# EasyEDA Pro project ProPrj_STM32音响_2025-06-08.epro, schematic Power_Lite
Board Name: Power_Lite; Create Date: 2025-05-30; Page Name: P1; Project Name: Project_NEO; Schematic Name: Power_Lite; Update Date: 2025-06-01; Company: 嘉立创EDA; Page Size: A4; Version: V1.0
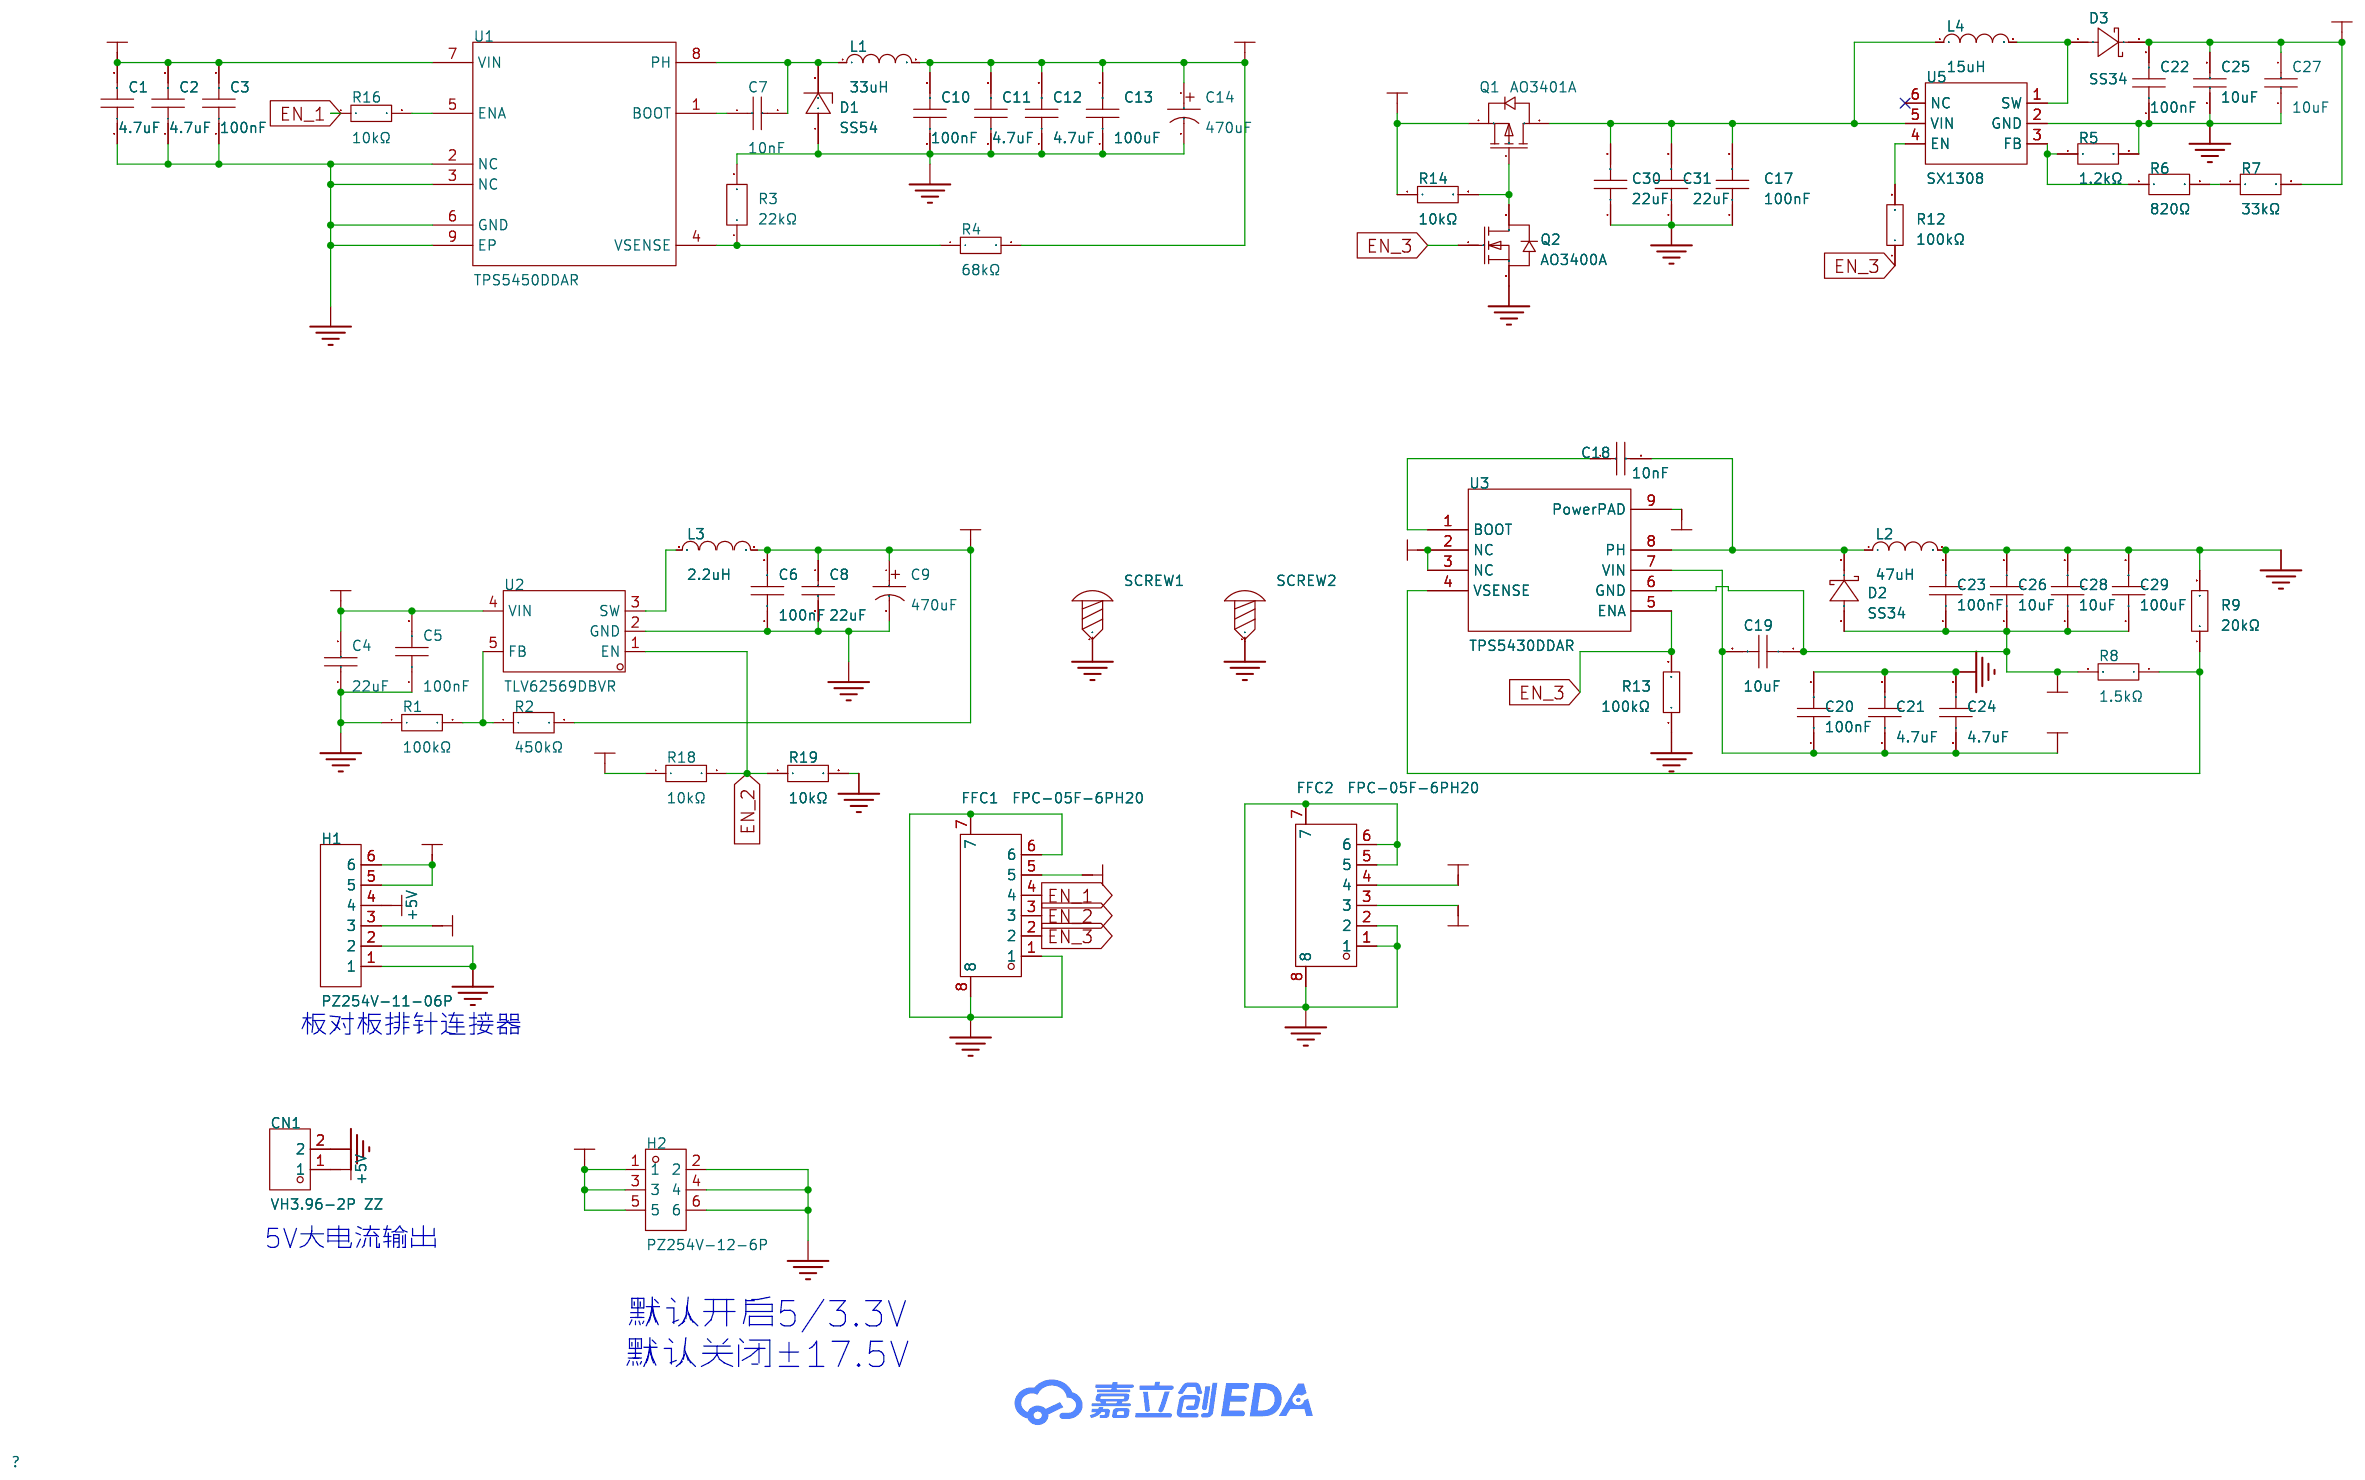
[diagram p4: schematic sheet]

## Parts
C1  4.7uF  [C0805]
C2  4.7uF  [C0805]
C3  100nF  [C0603]
C4  22uF  [C1206]
C5  100nF  [C0603]
C6  100nF  [C0603]
C7  10nF  [C0603]
C8  22uF  [C1206]
C9  470uF  [CAP-TH_BD6.3-P2.50-D1.0-FD]
C10  100nF  [C0603]
C11  4.7uF  [C0805]
C12  4.7uF  [C0805]
C13  100uF  [C1210]
C14  470uF  [CAP-TH_BD6.3-P2.50-D1.0-FD]
C17  100nF  [C0603]
C18  10nF  [C0603]
C19  10uF  [C1206]
C20  100nF  [C0603]
C21  4.7uF  [C0805]
C22  100nF  [C0603]
C23  100nF  [C0603]
C24  4.7uF  [C0805]
C25  10uF  [C1206]
C26  10uF  [C0805]
C27  10uF  [C1206]
C28  10uF  [C0805]
C29  100uF  [C1210]
C30  22uF  [C1206]
C31  22uF  [C1206]
CN1  VH3.96-2P ZZ  [CONN-TH_2P-P3.96_C9900035759]
D1  SS54  [SMA_L4.3-W2.6-LS5.0-FD]
D2  SS34  [SMA_L4.3-W2.6-LS5.0-FD]
D3  SS34  [SMA_L4.3-W2.6-LS5.0-FD]
FFC1  FPC-05F-6PH20  [FPC-SMD_6P-P0.50_XUNPU_FPC-05F-6PH20]
FFC2  FPC-05F-6PH20  [FPC-SMD_6P-P0.50_XUNPU_FPC-05F-6PH20]
H1  PZ254V-11-06P  [HDR-TH_6P-P2.54-V-M]
H2  PZ254V-12-6P  [HDR-TH_6P-P2.54-V-M-R2-C3-S2.54]
L1  33uH  [IND-SMD_L11.5-W10.0_FXL1040]
L2  47uH  [IND-SMD_L7.0-W6.6_FXL0630]
L3  2.2uH  [IND-SMD_L4.4-W4.2]
L4  15uH  [IND-SMD_L5.4-W5.2]
Q1  AO3401A  [SOT-23_L2.9-W1.3-P1.90-LS2.4-BR]
Q2  AO3400A  [SOT-23-3_L2.9-W1.3-P1.90-LS2.4-BR]
R1  100kΩ  [R0603]
R2  450kΩ  [R0402]
R3  22kΩ  [R0603]
R4  68kΩ  [R0603]
R5  1.2kΩ  [R0603]
R6  820Ω  [R0603]
R7  33kΩ  [R0603]
R8  1.5kΩ  [R0603]
R9  20kΩ  [R0603]
R12  100kΩ  [R0603]
R13  100kΩ  [R0603]
R14  10kΩ  [R0603]
R16  10kΩ  [R0603]
R18  10kΩ  [R0402]
R19  10kΩ  [R0402]
SCREW1  -  [M2螺丝]
SCREW2  -  [M2螺丝]
U1  TPS5450DDAR  [SOP-8_L4.9-W3.9-P1.27-LS6.0-BL-EP]
U2  TLV62569DBVR  [SOT-23-5_L3.0-W1.7-P0.95-LS2.8-BR]
U3  TPS5430DDAR  [ESOP-8_L4.9-W3.9-P1.27-LS6.0-TL-EP]
U5  SX1308  [SOT-23-6_L2.9-W1.6-P0.95-LS2.8-BL]

## Library data of the parts
C1 C2 C11 C12 C21 C24 = CGA0805X7R475K350MT: 容值:4.7uF;精度:±10%;额定电压:35V;材质(温度系数):X7R;; LCSC Part Name: 4.7uF ±10% 35V; Supplier Part: C6119943; Manufacturer: HRE(芯声); Supplier Footprint: 0805; JLCPCB Part Class: 扩展库; Supplier: LCSC; Tolerance: ±10%; Voltage Rated: 35V; Temperature Coefficient: X7R
C3 C5 C6 C10 C17 C20 C22 C23 = CGA0603X7R104K500JT: 容值:100nF;精度:±10%;额定电压:50V;材质(温度系数):X7R;; LCSC Part Name: 100nF ±10% 50V; Supplier Part: C6119867; Manufacturer: HRE(芯声); Supplier Footprint: 0603; JLCPCB Part Class: Extended Part; Supplier: LCSC; Tolerance: ±10%; Voltage Rated: 50V; Temperature Coefficient: X7R
C4 C8 = CL31A226KPHNNNE: 容值:22uF;精度:±10%;额定电压:10V;材质(温度系数):X5R;; LCSC Part Name: 22uF ±10% 10V; Supplier Part: C5672; Manufacturer: SAMSUNG(三星); Supplier Footprint: 1206; JLCPCB Part Class: 扩展库; Datasheet: https://atta.szlcsc.com/upload/public/pdf/source/20171115/C5672_15107278524311120028.pdf; Supplier: LCSC; Tolerance: ±10%; Voltage Rated: 10V; Temperature Coefficient: X5R
C7 C18 = CC0603KRX7R9BB103: 容值:10nF;精度:±10%;额定电压:50V;材质(温度系数):X7R;; LCSC Part Name: 10nF ±10% 50V; Supplier Part: C100042; Manufacturer: YAGEO(国巨); Supplier Footprint: 0603; JLCPCB Part Class: 扩展库; Datasheet: https://atta.szlcsc.com/upload/public/pdf/source/20181008/C309510_22F155564471FAF6A489F7D68F34234E.pdf; Supplier: LCSC; Tolerance: ±10%; Voltage Rated: 50V; Temperature Coefficient: X7R
C9 C14 = ERR1AM471E11OT: 容值:470uF;精度:±20%;额定电压:10V;纹波电流:-;等效串联电阻:-;; LCSC Part Name: 470uF ±20% 10V; Supplier Part: C112505; Manufacturer: AISHI(艾华集团); Supplier Footprint: 插件,D6.3xL11mm; JLCPCB Part Class: 扩展库; Datasheet: https://atta.szlcsc.com/upload/public/pdf/source/20190702/C401591_1676EF45BC9A88BD1D6B22BBAE3913C7.pdf; Supplier: LCSC; Tolerance: ±20%; Rated Voltage: 10V; Lead Spacing: 2.5mm; φD: 6.3mm; L: 11mm; Lifetime @ Temp: 2000hrs@105℃
C13 C29 = HGC1210R5107M160NSVK: 容值:100uF;精度:±20%;额定电压:16V;温度系数:X5R;; LCSC Part Name: 100uF ±20% 16V; Supplier Part: C7432790; Manufacturer: Chinocera(华瓷); Supplier Footprint: 1210; JLCPCB Part Class: 扩展库; Datasheet: https://atta.szlcsc.com/upload/public/pdf/source/20240320/FAC3FEC40A78BC5CCCE96C232A94D860.pdf; Supplier: LCSC; Tolerance: ±20%; Voltage Rating: 16V; Temperature Coefficient: X5R
C19 = HGC1206R5106K500NSPJ: 容值:10uF;精度:±10%;额定电压:50V;材质(温度系数):X5R;; LCSC Part Name: 10uF ±10% 50V; Supplier Part: C7432781; Manufacturer: Chinocera(华瓷); Supplier Footprint: 1206; JLCPCB Part Class: Extended Part; Datasheet: https://atta.szlcsc.com/upload/public/pdf/source/20240320/FAC3FEC40A78BC5CCCE96C232A94D860.pdf; Supplier: LCSC; Tolerance: ±10%; Voltage Rated: 50V; Temperature Coefficient: X5R
C25 C27 = CL31A106KAHNNNE: 容值:10uF;精度:±10%;额定电压:25V;材质(温度系数):X5R;; LCSC Part Name: 10uF ±10% 25V; Supplier Part: C9807; Manufacturer: SAMSUNG(三星); Supplier Footprint: 1206; JLCPCB Part Class: 扩展库; Datasheet: https://atta.szlcsc.com/upload/public/pdf/source/20160218/1457707763339.pdf; Supplier: LCSC; Tolerance: ±10%; Voltage Rated: 25V; Temperature Coefficient: X5R
C26 C28 = CGA0805X5R106K250MT: 容值:10uF;精度:±10%;额定电压:25V;温度系数:X5R;; LCSC Part Name: 10uF ±10% 25V; Supplier Part: C6119887; Manufacturer: HRE(芯声); Supplier Footprint: 0805; JLCPCB Part Class: 扩展库; Supplier: LCSC; Tolerance: ±10%; Voltage Rating: 25V; Temperature Coefficient: X5R
C30 C31 = CGA1206X5R226M350NT: 容值:22uF;精度:±20%;额定电压:35V;温度系数:X5R;; LCSC Part Name: 22uF ±20% 35V; Supplier Part: C6119969; Manufacturer: HRE(芯声); Supplier Footprint: 1206; JLCPCB Part Class: 扩展库; Supplier: LCSC; Tolerance: ±20%; Voltage Rating: 35V; Temperature Coefficient: X5R
CN1 = VH3.96-2P ZZ: 插针结构:1x2P;间距:3.96mm;安装方式:直插;参考系列:VH;总PIN数:2P;排数:1;每排PIN数:2;行距:-;额定电流:7A;触头材质:黄铜;触头镀层:锡;工作温度范围:-25℃~+85℃;; LCSC Part Name: 1x2P 间距:3.96mm 直插 系列:VH; Supplier Part: C5379868; Manufacturer: SHOU HAN(首韩); Supplier Footprint: 插件,P=3.96mm; JLCPCB Part Class: 扩展库; Supplier: LCSC; Pins Structure: 1x2P; Pitch: 3.96mm; Mounting Type: 直插; Reference Series: VH; Number of Pins: 2P; Number of Rows: 1; Number of PINs Per Row: 2; Current Rating: 7A; Contact Material: 黄铜; Contact Plating: 锡; Operating Temperature: -25℃~+85℃; Voltage Rating: 250V; Plastic Material: PA66; Flame Retardant Rating: UL94V-0; Color: 白色
D1 = SS54_C7420369: 二极管配置:独立式;正向压降(Vf):550mV@5.0A;直流反向耐压(Vr):40V;整流电流:5A;; LCSC Part Name: 电压:40V 电流:5A; Supplier Part: C7420369; Manufacturer: 宏迦橙; Supplier Footprint: SMA(DO-214AC); JLCPCB Part Class: 扩展库; Datasheet: https://atta.szlcsc.com/upload/public/pdf/source/20230828/254C3882F8647358AD9F60DD73611B5E.pdf; Supplier: LCSC; Diode Configuration: 独立式; Forward Voltage (Vf@If): 550mV@5.0A; Reverse Voltage (Vr): 40V; Rectified Current: 5A; Reverse Leakage Current (Ir): 50uA@40V
D2 D3 = SS34_C7420365: 二极管配置:独立式;正向压降(Vf):550mV@3.0A;直流反向耐压(Vr):40V;平均整流电流(Io):3A;; LCSC Part Name: 电压:40V 电流:3A; Supplier Part: C7420365; Manufacturer: 宏迦橙; Supplier Footprint: SMA(DO-214AC); JLCPCB Part Class: 扩展库; Datasheet: https://atta.szlcsc.com/upload/public/pdf/source/20230828/75438452AEE6C276EDA92B2AF599BE05.pdf; Supplier: LCSC; Diode Configuration: 独立式; Forward Voltage (Vf@If): 550mV@3.0A; Reverse Voltage (Vr): 40V; Average Rectified Current (Io): 3A; Reverse Leakage Current (Ir): 200uA@40V; Peak forward surge current: 80A
FFC1 FFC2 = FPC-05F-6PH20: 锁定特性:翻盖式;触点类型:下接;触点数量:6P;间距:0.5mm;安装类型:卧贴;工作温度范围:-25℃~+85℃;; LCSC Part Name: 间距:0.5mm P数:6P 翻盖式 下接; Supplier Part: C2856796; Manufacturer: XUNPU(讯普); Supplier Footprint: SMD,P=0.5mm,卧贴; JLCPCB Part Class: 扩展库; Datasheet: https://atta.szlcsc.com/upload/public/pdf/source/20210922/16B003FB53336DDF6538142CC465AC4D.pdf; Supplier: LCSC; Locking Feature: 翻盖式; Contact Type: 下接; Number of Contacts: 6P; Pitch: 0.5mm; Mounting Type: 卧贴; FFC, FCB Thickness: 0.3mm; Height Above Board: 2mm; Operating Temperature Range: -25℃~+85℃
H1 = PZ254V-11-06P: 插针结构:1x6P;间距:2.54mm;行距:-;圆针/方针:方针;安装方式:直插;排数:单排;总PIN位数:6P;额定电流:-;额定电压:-;配合针长度:6mm;塑高:2.5mm;端接针长度:3mm;触头材质:黄铜;触头镀层:-;工作温度:-40℃~+105℃;颜色:黑色;; LCSC Part Name: 1x6P 间距:2.54mm 方针 直插; Supplier Part: C492405; Manufacturer: XFCN(兴飞); Supplier Footprint: 插件,P=2.54mm; JLCPCB Part Class: Extended Part; Datasheet: https://atta.szlcsc.com/upload/public/pdf/source/20200309/C492405_597F1930F5B55CC3C7FD95458F1C3977.pdf; Supplier: LCSC; Pin Structure: 1x6P; Pitch: 2.54mm; Circluar Pins/Square Pins: 方针; Mounting Type: 直插; Number of Rows: 单排; Number of Pins: 6P; Length of Mating Pin: 6mm; Insulation Height: 2.5mm; Length of End Connection Pin: 3mm; Contact Material: 黄铜; Operating Temperature: -40℃~+105℃; Color: 黑色
H2 = PZ254V-12-6P: 插针结构:2x3P;间距:2.54mm;行距:2.54mm;圆针/方针:方针;安装类型:直插;排数:双排;总PIN位数:6P;额定电流:-;额定电压:-;配合针长度:6mm;塑高:2.5mm;端接针长度:3mm;触头材质:黄铜;触头镀层:-;工作温度范围:-40℃~+105℃;颜色:黑色;; LCSC Part Name: 间距:2.54mm 2x3P 直插 方针; Supplier Part: C492420; Manufacturer: XFCN(兴飞); Supplier Footprint: 插件,P=2.54mm; JLCPCB Part Class: 扩展库; Datasheet: https://atta.szlcsc.com/upload/public/pdf/source/20200309/C492420_BAECB307B001054C09D200388220EAE6.pdf; Supplier: LCSC; Pin Structure: 2x3P; Pitch: 2.54mm; Row Spacing: 2.54mm; Circluar Pins/Square Pins: 方针; Mounting Type: 直插; Number of Rows: 双排; Number of Pins: 6P; Length of Mating Pin: 6mm; Insulation Height: 2.5mm; Length of End Connection Pin: 3mm; Contact Material: 黄铜; Operating Temperature Range: -40℃~+105℃; Color: 黑色
L1 = FXL1040-330-M: 电感值:33uH;精度:±20%;额定电流:4.4A;饱和电流(Isat):5A;类型:一体成型电感;; LCSC Part Name: 33uH ±20% 5A; Supplier Part: C475918; Manufacturer: cjiang(长江微电); Supplier Footprint: SMD,11.5x10mm; JLCPCB Part Class: 扩展库; Datasheet: https://atta.szlcsc.com/upload/public/pdf/source/20240426/3189EA8206330E2108542F9E34E540E7.pdf; Supplier: LCSC; Tolerance: ±20%; Rated Current: 4.4A; Saturation Current (Isat): 5A; DC Resistance (DCR): 92mΩ; Type: 一体成型电感
L2 = FXL0630-470-M: 电感值:47uH;精度:±20%;额定电流:1.5A;饱和电流(Isat):2A;类型:一体成型电感;; LCSC Part Name: 47uH ±20% 2A; Supplier Part: C475913; Manufacturer: cjiang(长江微电); Supplier Footprint: SMD,6.6x7mm; JLCPCB Part Class: Extended Part; Datasheet: https://atta.szlcsc.com/upload/public/pdf/source/20240426/3189EA8206330E2108542F9E34E540E7.pdf; Supplier: LCSC; Tolerance: ±20%; Rated Current: 1.5A; Saturation Current (Isat): 2A; DC Resistance (DCR): 385mΩ; Type: 一体成型电感
L3 = FXL0420-2R2-M: 电感值:2.2uH;精度:±20%;额定电流:4.5A;饱和电流(Isat):5A;类型:一体成型电感;; LCSC Part Name: 2.2uH ±20% 5A; Supplier Part: C167206; Manufacturer: cjiang(长江微电); Supplier Footprint: SMD,4.2x4.4mm; JLCPCB Part Class: Extended Part; Datasheet: https://atta.szlcsc.com/upload/public/pdf/source/20240426/3189EA8206330E2108542F9E34E540E7.pdf; Supplier: LCSC; Tolerance: ±20%; Rated Current: 4.5A; Saturation Current (Isat): 5A; DC Resistance (DCR): 58mΩ; Type: 一体成型电感
L4 = FXL0530-150-M: 电感值:15uH;精度:±20%;额定电流:1.7A;饱和电流(Isat):2.2A;类型:一体成型电感;; LCSC Part Name: 15uH ±20% 2.2A; Supplier Part: C7471117; Manufacturer: cjiang(长江微电); Supplier Footprint: SMD,5.2x5.4mm; JLCPCB Part Class: 扩展库; Datasheet: https://atta.szlcsc.com/upload/public/pdf/source/20240426/3189EA8206330E2108542F9E34E540E7.pdf; Supplier: LCSC; Tolerance: ±20%; Rated Current: 1.7A; Saturation Current (Isat): 2.2A; DC Resistance (DCR): 180mΩ; Type: 一体成型电感
Q1 = AO3401A_C347476: 类型:1个P沟道;漏源电压(Vdss):30V;连续漏极电流(Id):4.2A;导通电阻(RDS(on)@Vgs,Id):50mΩ@10V;功率(Pd):1.4W;阈值电压(Vgs(th)@Id):400mV@250uA;; LCSC Part Name: 1个P沟道 耐压:30V 电流:4.2A; Supplier Part: C347476; Manufacturer: UMW(友台半导体); Supplier Footprint: SOT-23; JLCPCB Part Class: 扩展库; Datasheet: https://atta.szlcsc.com/upload/public/pdf/source/20231109/42F312EBB081D72F04A7E8221BFFAF9D.pdf; Supplier: LCSC; Type: 1个P沟道; Drain Source Voltage (Vdss): 30V; Continuous Drain Current (Id): 4.2A; Drain Source On Resistance (RDS(on)@Vgs,Id): 50mΩ@10V; Power Dissipation (Pd): 1.4W; Gate Threshold Voltage (Vgs(th)@Id): 400mV@250uA; Total Gate Charge (Qg@Vgs): 9.4nC@4.5V; Input Capacitance (Ciss@Vds): 954pF; Reverse Transfer Capacitance (Crss@Vds): 77pF; Operating Temperature: -55℃~+150℃
Q2 = AO3400A_C347475: 类型:1个N沟道;漏源电压(Vdss):30V;连续漏极电流(Id):5.8A;导通电阻(RDS(on)@Vgs,Id):28mΩ@10V,5.8A;功率(Pd):1.4W;阈值电压(Vgs(th)@Id):1.4V@250uA;; LCSC Part Name: 1个N沟道 耐压:30V 电流:5.8A; Supplier Part: C347475; Manufacturer: UMW(友台半导体); Supplier Footprint: SOT-23; JLCPCB Part Class: Extended Part; Datasheet: https://atta.szlcsc.com/upload/public/pdf/source/20231109/50AB4FB4D66E55864F9B8D027B723C9A.pdf; Supplier: LCSC; Type: 1个N沟道; Drain Source Voltage (Vdss): 30V; Continuous Drain Current (Id): 5.8A; Drain Source On Resistance (RDS(on)@Vgs,Id): 28mΩ@10V,5.8A; Power Dissipation (Pd): 1.4W; Gate Threshold Voltage (Vgs(th)@Id): 1.4V@250uA; Total Gate Charge (Qg@Vgs): 12nC@10V; Input Capacitance (Ciss@Vds): 1.05nF@24V; Reverse Transfer Capacitance (Crss@Vds): 77pF@15V; Operating Temperature: -55℃~+150℃
R1 R12 R13 = 0603WAF1003T5E: 电阻类型:厚膜电阻;阻值:100kΩ;精度:±1%;功率:100mW;最大工作电压:75V;温度系数:±100ppm/℃;; LCSC Part Name: 100kΩ ±1% 100mW 厚膜电阻; Supplier Part: C25803; Manufacturer: UNI-ROYAL(厚声); Supplier Footprint: 0603; JLCPCB Part Class: Basic Part; Datasheet: https://atta.szlcsc.com/upload/public/pdf/source/20200306/C422600_1E6D84923E4A46A82E41ADD87F860B5C.pdf; Supplier: LCSC; Type: 厚膜电阻; Tolerance: ±1%; Power(Watts): 100mW; Overload Voltage (Max): 75V; Temperature Coefficient: ±100ppm/℃; Operating Temperature Range: -55℃~+155℃
R2 = FRC0402F4503TS: 电阻类型:厚膜电阻;阻值:450kΩ;精度:±1%;功率:62.5mW;最大工作电压:50V;温度系数:±100ppm/℃;; LCSC Part Name: 450kΩ ±1% 62.5mW 厚膜电阻; Supplier Part: C5159688; Manufacturer: FOJAN(富捷); Supplier Footprint: 0402; JLCPCB Part Class: Extended Part; Datasheet: https://atta.szlcsc.com/upload/public/pdf/source/20211221/925EC7D7225764EE0046F22065062C87.pdf; Supplier: LCSC; Type: 厚膜电阻; Tolerance: ±1%; Power(Watts): 62.5mW; Overload Voltage (Max): 50V; Temperature Coefficient: ±100ppm/℃
R3 = FRC0603F2202TS: 电阻类型:厚膜电阻;阻值:22kΩ;精度:±1%;功率:100mW;工作电压:75V;温度系数:±100ppm/℃;; LCSC Part Name: 22kΩ ±1% 100mW 厚膜电阻; Supplier Part: C2907015; Manufacturer: FOJAN(富捷); Supplier Footprint: 0603; JLCPCB Part Class: 扩展库; Datasheet: https://atta.szlcsc.com/upload/public/pdf/source/20211221/925EC7D7225764EE0046F22065062C87.pdf; Supplier: LCSC; Type: 厚膜电阻; Tolerance: ±1%; Power(Watts): 100mW; Voltage-Supply(Max): 75V; Temperature Coefficient: ±100ppm/℃; Operating Temperature: -55℃~+155℃
R4 = 0603WAF6802T5E: 电阻类型:厚膜电阻;阻值:68kΩ;精度:±1%;功率:100mW;最大工作电压:75V;温度系数:±100ppm/℃;; LCSC Part Name: 68kΩ ±1% 100mW 厚膜电阻; Supplier Part: C23231; Manufacturer: UNI-ROYAL(厚声); Supplier Footprint: 0603; JLCPCB Part Class: 基础库; Datasheet: https://atta.szlcsc.com/upload/public/pdf/source/20200306/C422600_1E6D84923E4A46A82E41ADD87F860B5C.pdf; Supplier: LCSC; Type: 厚膜电阻; Tolerance: ±1%; Power(Watts): 100mW; Overload Voltage (Max): 75V; Temperature Coefficient: ±100ppm/℃; Operating Temperature Range: -55℃~+155℃
R5 = FRC0603F1201TS: 电阻类型:厚膜电阻;阻值:1.2kΩ;精度:±1%;功率:100mW;最大工作电压:75V;温度系数:±100ppm/℃;; LCSC Part Name: 1.2kΩ ±1% 100mW 厚膜电阻; Supplier Part: C2906976; Manufacturer: FOJAN(富捷); Supplier Footprint: 0603; JLCPCB Part Class: Extended Part; Datasheet: https://atta.szlcsc.com/upload/public/pdf/source/20211221/925EC7D7225764EE0046F22065062C87.pdf; Supplier: LCSC; Type: 厚膜电阻; Tolerance: ±1%; Power(Watts): 100mW; Overload Voltage (Max): 75V; Temperature Coefficient: ±100ppm/℃; Operating Temperature Range: -55℃~+155℃
R6 = FRC0603F8200TS: 电阻类型:厚膜电阻;阻值:820Ω;精度:±1%;功率:100mW;工作电压:75V;温度系数:±100ppm/℃;; LCSC Part Name: 820Ω ±1% 100mW 厚膜电阻; Supplier Part: C2907071; Manufacturer: FOJAN(富捷); Supplier Footprint: 0603; JLCPCB Part Class: 扩展库; Datasheet: https://atta.szlcsc.com/upload/public/pdf/source/20211221/925EC7D7225764EE0046F22065062C87.pdf; Supplier: LCSC; Type: 厚膜电阻; Tolerance: ±1%; Power(Watts): 100mW; Voltage-Supply(Max): 75V; Temperature Coefficient: ±100ppm/℃; Operating Temperature: -55℃~+155℃
R7 = FRC0603F3302TS: 电阻类型:厚膜电阻;阻值:33kΩ;精度:±1%;功率:100mW;工作电压:75V;温度系数:±100ppm/℃;; LCSC Part Name: 33kΩ ±1% 100mW 厚膜电阻; Supplier Part: C2907028; Manufacturer: FOJAN(富捷); Supplier Footprint: 0603; JLCPCB Part Class: 扩展库; Datasheet: https://atta.szlcsc.com/upload/public/pdf/source/20211221/925EC7D7225764EE0046F22065062C87.pdf; Supplier: LCSC; Type: 厚膜电阻; Tolerance: ±1%; Power(Watts): 100mW; Voltage-Supply(Max): 75V; Temperature Coefficient: ±100ppm/℃; Operating Temperature: -55℃~+155℃
R8 = 0603WAF1501T5E: 电阻类型:厚膜电阻;阻值:1.5kΩ;精度:±1%;功率:100mW;最大工作电压:75V;温度系数:±100ppm/℃;; LCSC Part Name: 1.5kΩ ±1% 100mW 厚膜电阻; Supplier Part: C22843; Manufacturer: UNI-ROYAL(厚声); Supplier Footprint: 0603; JLCPCB Part Class: 基础库; Datasheet: https://atta.szlcsc.com/upload/public/pdf/source/20200306/C422600_1E6D84923E4A46A82E41ADD87F860B5C.pdf; Supplier: LCSC; Type: 厚膜电阻; Tolerance: ±1%; Power(Watts): 100mW; Overload Voltage (Max): 75V; Temperature Coefficient: ±100ppm/℃; Operating Temperature Range: -55℃~+155℃
R9 = 0603WAF2002T5E: 电阻类型:厚膜电阻;阻值:20kΩ;精度:±1%;功率:100mW;最大工作电压:75V;温度系数:±100ppm/℃;; LCSC Part Name: 20kΩ ±1% 100mW 厚膜电阻; Supplier Part: C4184; Manufacturer: UNI-ROYAL(厚声); Supplier Footprint: 0603; JLCPCB Part Class: 基础库; Datasheet: https://atta.szlcsc.com/upload/public/pdf/source/20200306/C422600_1E6D84923E4A46A82E41ADD87F860B5C.pdf; Supplier: LCSC; Type: 厚膜电阻; Tolerance: ±1%; Power(Watts): 100mW; Overload Voltage (Max): 75V; Temperature Coefficient: ±100ppm/℃; Operating Temperature Range: -55℃~+155℃
R14 R16 = 0603WAF1002T5E: 电阻类型:厚膜电阻;阻值:10kΩ;精度:±1%;功率:100mW;最大工作电压:75V;温度系数:±100ppm/℃;; LCSC Part Name: 厚膜电阻 10kΩ ±1% 100mW; Supplier Part: C25804; Manufacturer: UNI-ROYAL(厚声); Supplier Footprint: 0603; JLCPCB Part Class: 基础库; Datasheet: https://atta.szlcsc.com/upload/public/pdf/source/20200306/C422600_1E6D84923E4A46A82E41ADD87F860B5C.pdf; Supplier: LCSC; Type: 厚膜电阻; Tolerance: ±1%; Power(Watts): 100mW; Overload Voltage (Max): 75V; Temperature Coefficient: ±100ppm/℃; Operating Temperature Range: -55℃~+155℃
R18 R19 = 0402WGF1002TCE: 电阻类型:厚膜电阻;阻值:10kΩ;精度:±1%;功率:62.5mW;最大工作电压:50V;温度系数:±100ppm/℃;; LCSC Part Name: 10kΩ ±1% 62.5mW 厚膜电阻; Supplier Part: C25744; Manufacturer: UNI-ROYAL(厚声); Supplier Footprint: 0402; JLCPCB Part Class: 基础库; Datasheet: https://atta.szlcsc.com/upload/public/pdf/source/20200306/C422600_1E6D84923E4A46A82E41ADD87F860B5C.pdf; Supplier: LCSC; Type: 厚膜电阻; Tolerance: ±1%; Power(Watts): 62.5mW; Overload Voltage (Max): 50V; Temperature Coefficient: ±100ppm/℃; Operating Temperature Range: -55℃~+155℃
SCREW1 SCREW2 = M2螺丝: Supplier Footprint: 插件
U1 = TPS5450DDAR: 功能类型:降压型;输出类型:可调;输入电压:5.5V~36V;输出电压:1.221V~31.32V;输出电流(最大值):5A;; Supplier Part: C114425; Manufacturer: TI(德州仪器); Supplier Footprint: SOP-8-EP-150mil; JLCPCB Part Class: Extended Part; Datasheet: https://www.ti.com/cn/lit/gpn/tps5450; Supplier: LCSC; Function: 降压型; Output Type: 可调; Input Voltage: 5.5V~36V; Output Voltage: 1.221V~31.32V; Output Current (Max): 5A; Switching Frequency: 500kHz; Operating Temperature: -40℃~+125℃@(TJ); Synchronous Rectification: 否; Number of Outputs: 1; Topology: 降压式; Switch tube (built-in/external): 内置
U2 = TLV62569DBVR: 功能类型:降压型;输出类型:可调;工作电压:2.5V~5.5V;输出电压:600mV~5.5V;输出电流:2A;; LCSC Part Name: 高效率同步降压转换器; Supplier Part: C141836; Manufacturer: TI(德州仪器); Supplier Footprint: SOT-23-5; JLCPCB Part Class: 扩展库; Datasheet: https://www.ti.com/cn/lit/gpn/tlv62569; Supplier: LCSC; Function: 降压型; Output Type: 可调; Input Voltage: 2.5V~5.5V; Output Voltage: 600mV~5.5V; Output Current: 2A; Switching Frequency: 1.5MHz; Operating Temperature: -40℃~+125℃@(TJ); Synchronous Rectification: 是; Topology: 降压式; Switch tube (built-in/external): 内置
U3 = TPS5430DDAR: 功能类型:降压型;输出类型:可调;工作电压:5.5V~36V;输出电压:1.221V~32.04V;输出电流:3A;; LCSC Part Name: 宽输入范围、3A输出电流的降压转换器; Supplier Part: C9864; Manufacturer: TI(德州仪器); Supplier Footprint: SOIC-8-EP; JLCPCB Part Class: Basic Part; Datasheet: https://www.ti.com/cn/lit/gpn/tps5430; Supplier: LCSC; Function: 降压型; Output Type: 可调; Input Voltage: 5.5V~36V; Output Voltage: 1.221V~32.04V; Output Current: 3A; Switching Frequency: 500kHz; Operating Temperature: -40℃~+125℃@(TJ); Synchronous Rectification: 否; Number of Outputs: 1; Topology: 降压式; Switch tube (built-in/external): 内置
U5 = SX1308: 功能类型:升压型;输出类型:可调;工作电压:2V~24V;输出电压:28V;输出电流:2A;; LCSC Part Name: 高效1.2MHz 2A升压转换器; Supplier Part: C78162; Manufacturer: SX(硕芯科技); Supplier Footprint: SOT-23-6; JLCPCB Part Class: 扩展库; Datasheet: https://atta.szlcsc.com/upload/public/pdf/source/20160920/1474356679185.pdf; Supplier: LCSC; Function: 升压型; Output Type: 可调; Voltage - Supply: 2V~24V; Output Voltage: 28V; Output Current: 2A; Frequency - Switching: 1.2MHz; Operating Temperature: -40℃~+85℃; Synchronous Rectifier: 否; Number of Outputs: 1; Topology: 升压式; Quiescent Current: 100uA; Switch tube (built-in/external): 内置

## Nets
+3.3V: C6.2 C8.1 C9.1 FFC1.5 H1.3 H2.1 H2.3 H2.5 L3.2 R2.2
+5V: C4.2 C5.2 C10.2 C11.2 C12.2 C13.2 C14.1 CN1.1 H1.4 L1.2 R4.2 R18.1 U2.4(VIN)
+17.5V: C22.2 C25.2 C27.2 D3.2(K) FFC2.4 R7.2
-17.5V: C19.1 C23.1 C26.1 C28.1 C29.1 D2.1(A) FFC2.3 R8.2 U3.2(NC) U3.3(NC) U3.6(GND) U3.9(PowerPAD)
GND: C1.1 C2.1 C3.1 C4.1 C5.1 C6.1 C8.2 C9.2 C10.1 C11.1 C12.1 C13.1 C14.2 C17.1 C20.2 C21.2 C22.1 C23.2 C24.2 C25.1 C26.2 C27.1 C28.2 C29.2 C30.1 C31.1 CN1.2 D1.1(A) FFC1.1 FFC1.6 FFC1.7 FFC1.8 FFC2.1 FFC2.2 FFC2.5 FFC2.6 FFC2.7 FFC2.8 H1.1 H1.2 H2.2 H2.4 H2.6 L2.2 Q2.2(S) R1.1 R3.2 R5.2 R9.2 R13.1 R19.2 SCREW1.1 SCREW2.1 U1.2(NC) U1.3(NC) U1.6(GND) U1.9(EP) U2.2(GND) U5.2(GND)
BAT+: C1.2 C2.2 C3.2 C19.2 C20.1 C21.1 C24.1 H1.5 H1.6 Q1.2(S) R14.1 U1.7(VIN) U3.7(VIN)
EN_1: FFC1.4 R16.1
EN_2: FFC1.3 R18.2 R19.1 U2.1(EN)
EN_3: FFC1.2 Q2.1(G) R12.1 R13.2 U3.5(ENA)
$1N343: C7.1 U1.1(BOOT)
$1N381: C7.2 D1.2(K) L1.1 U1.8(PH)
$1N905: R3.1 R4.1 U1.4(VSENSE)
$1N1881: R1.2 R2.1 U2.5(FB)
$1N2252: R12.2 U5.4(EN)
$1N2721: D3.1(A) L4.2 U5.1(SW)
$1N3092: R6.2 R7.1
$1N3170: R5.1 R6.1 U5.3(FB)
$1N3455: C18.2 D2.2(K) L2.1 U3.8(PH)
$1N3608: C18.1 U3.1(BOOT)
$1N5180: R8.1 R9.1 U3.4(VSENSE)
$1N9796: C17.2 C30.2 C31.2 L4.1 Q1.3(D) U5.5(VIN)
$1N10633: Q1.1(G) Q2.3(D) R14.2
$1N14307: R16.2 U1.5(ENA)
$1N14408: L3.1 U2.3(SW)

Not connected (* = marked no-connect by the designer): U5 6(NC)*

## Notes on the sheet
- 板对板排针连接器
- 5V大电流输出
- 默认开启5/3.3V
  默认关闭±17.5V
